# Altium schematic sheet main.SchDoc
size A4
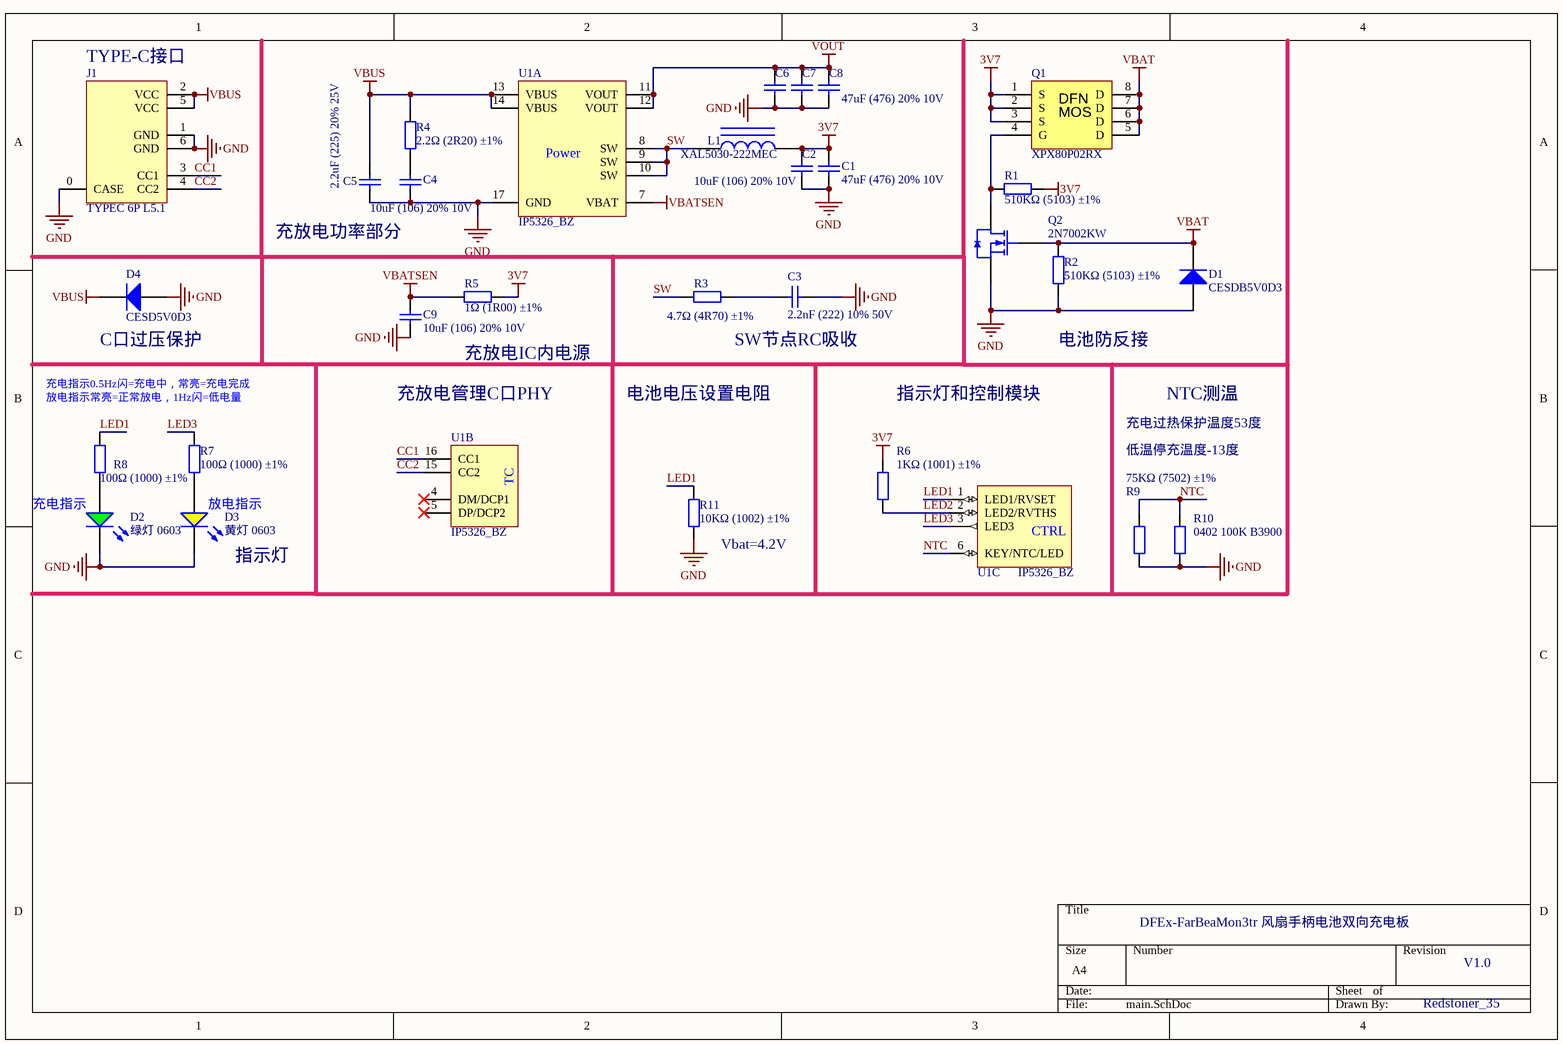
[diagram p0: main.SchDoc]

## Parts
C1  47uF (476) 20% 10V  [0805_C]
C2  10uF (106) 20% 10V  [0402_C]
C3  2.2nF (222) 10% 50V  [0402_C]
C4  10uF (106) 20% 10V  [0402_C]
C5  2.2uF (225) 20% 25V  [0402_C]
C6  47uF (476) 20% 10V  [0805_C]  (value not drawn)
C7  47uF (476) 20% 10V  [0805_C]  (value not drawn)
C8  47uF (476) 20% 10V  [0805_C]
C9  10uF (106) 20% 10V  [0402_C]
D1  CESDB5V0D3  [SOD-323]
D2  绿灯 0603  [0603_LED_S1]
D3  黄灯 0603  [0603_LED_S1]
D4  CESD5V0D3  [SOD-323]
J1  TYPEC 6P L5.1  [TYPEC 6P两脚插板SMT L5.1]
L1  XAL5030-222MEC  [FEXL0520A-***M]
Q1  XPX80P02RX  [DFN-8_L3.0-W3.0-P0.65-BL]
Q2  2N7002KW  [SC70-3]
R1  510KΩ (5103) ±1%  [0402_R]
R2  510KΩ (5103) ±1%  [0402_R]
R3  4.7Ω (4R70) ±1%  [0402_R]
R4  2.2Ω (2R20) ±1%  [0402_R]
R5  1Ω (1R00) ±1%  [0805_R]
R6  1KΩ (1001) ±1%  [0402_R]
R7  100Ω (1000) ±1%  [0402_R]
R8  100Ω (1000) ±1%  [0402_R]
R9  75KΩ (7502) ±1%  [0402_R]
R10  0402 100K B3900  [0402_R]
R11  10KΩ (1002) ±1%  [0402_R]
U1  IP5326_BZ  [QFN33-16L-IP5326]  (parts A,B,C of 3)

## Nets
3V7: C1.2 C2.2 L1.2 Q1.1(S) Q1.2(S) Q1.3(S) R1.1 R5.2 R6.1
GND: C1.1 C2.1 C3.1 C4.1 C5.1 C6.1 C7.1 C8.1 C9.1 D1.1(A) D2.K D3.K D4.1(A) J1.0(CASE) J1.1(GND) J1.6(GND) Q2.2(S) R2.1 R9.1 R10.1 R11.1 U1.17(GND)
VBAT: D1.2(K) Q1.5(D) Q1.6(D) Q1.7(D) Q1.8(D) Q2.1(G) R2.2
VBATSEN: C9.2 R5.1 U1.7(VBAT)
VBUS: C5.2 D4.2(K) J1.2(VCC) J1.5(VCC) R4.2 U1.13(VBUS) U1.14(VBUS)
VOUT: C6.2 C7.2 C8.2 U1.11(VOUT) U1.12(VOUT)
CC1: J1.3(CC1) U1.16(CC1)
CC2: J1.4(CC2) U1.15(CC2)
LED1: R8.2 R11.2 U1.1(LED1/RVSET)
LED2: R6.2 U1.2(LED2/RVTHS)
LED3: R7.2 U1.3(LED3)
NTC: R9.2 R10.2 U1.6(KEY/NTC/LED)
SW: L1.1 R3.2 U1.8(SW) U1.9(SW) U1.10(SW)
NetC3_2: C3.2 R3.1
NetC4_2: C4.2 R4.1
NetD2_A: D2.A R8.1
NetD3_A: D3.A R7.1
NetQ1_4: Q1.4(G) Q2.3(D) R1.2

Not connected (* = marked no-connect by the designer): U1 4(DM/DCP1)* 5(DP/DCP2)*

## Notes on the sheet
- (near J1) TYPE-C接口
- (near C5) 充放电功率部分
- 充电指示0.5Hz闪=充电中，常亮=充电完成
- (near D4) C口过压保护
- 充放电IC内电源
- SW节点RC吸收
- (near R2) 电池防反接
- 放电指示常亮=正常放电，1Hz闪=低电量
- 充放电管理C口PHY
- 电池电压设置电阻
- 指示灯和控制模块
- 充电过热保护温度53度
- 低温停充温度-13度
- NTC测温
- 充电指示
- (near D3) 放电指示
- (near D3) 指示灯
- (near R11) Vbat=4.2V
- DFEx-FarBeaMon3tr 风扇手柄电池双向充电板
- V1.0
- Redstoner_35
- (in symbol IP5326_BZ, part A) Power
- (in symbol IP5326_BZ, part B) TC
- (in symbol IP5326_BZ, part C) CTRL
- (in symbol SON/DFN5x6 MOS) DFN; MOS

## Library data of the parts
C1 C6-C8 = 0805 22uF (226) 20% 25V: 贴片电容; ComponentLink1Description: 供应商链接; ComponentLink1URL: http://www.szlcsc.com/product/details_46786.html; Package: 0805; Supplier: LC; SuppliersPartNumber: C45783
C2 C4 C9 = 0402 10uF (106) 20% 6.3V: 贴片电容; ComponentLink1Description: 供应商链接; ComponentLink1URL: http://www.szlcsc.com/product/details_16204.html; Package: 0402; Supplier: LC; SuppliersPartNumber: C15525
C3 = 0402 2.2nF (222) 10% 50V: 贴片电容; ComponentLink1Description: 供应商链接; ComponentLink1URL: http://www.szlcsc.com/product/details_1883.html; Package: 0402; Supplier: LC; SuppliersPartNumber: C1531
C5 = 0402 1.0uF (105) 10% 25V: 贴片电容; ComponentLink1Description: 供应商链接; ComponentLink1URL: http://www.szlcsc.com/product/details_53938.html; Package: 0402; Supplier: LC; SuppliersPartNumber: C52923
D1 D4 = SOD-323 1N4148WS T4: 5V额定工作电压，6.2V击穿电压双向TVS管，SOD-323; ComponentLink1Description: 供应商链接; ComponentLink1URL: http://www.szlcsc.com/product/details_2485.html; Package: SOD-323; Supplier: LC; SuppliersPartNumber: C2128
D2 = 0603 绿灯: 发光二极管; ComponentLink1Description: 供应商链接; ComponentLink1URL: http://www.szlcsc.com/product/details_73152.html; Package: 0603; Supplier: LC; SuppliersPartNumber: C72043
D3 = 0603 黄灯: 发光二极管; ComponentLink1Description: 供应商链接; ComponentLink1URL: http://www.szlcsc.com/product/details_73147.html; Package: 0603; Supplier: LC; SuppliersPartNumber: C72038
J1 = TYPEC 6P: TYPEC连接器 6P 2脚插板SMT 5.1长度
L1 = Inductor Iron: 线艺XAL5030 2.2uH一体成型T-Core电感; Value: 2.2uH; Published: 24-Mar-1999; LatestRevisionDate: 17-Jul-2002; LatestRevisionNote: Re-released for DXP Platform.; PackageReference: AXIAL-0.9; Publisher: Altium Limited; PackageDescription: Axial Device, Thru-Hole; 2 Leads; 0.9 in Pin Spacing
Q1 = SON/DFN5x6 MOS: PDFN3x3 20V 80A 4..0mΩ [P-Ch MOSFET
Q2 = 2N7002 7002: 单N沟道MOSFET(场效应管); ComponentLink1Description: 供应商链接; ComponentLink1URL: http://www.szlcsc.com/product/details_9040.html; Package: SOT-323; Supplier: LC; SuppliersPartNumber: C???????
R1 R2 = 0402 510KΩ (5103) 1%: 贴片电阻; ComponentLink1Description: 供应商链接; ComponentLink1URL: http://www.szlcsc.com/product/details_12170.html; Package: 0402; Supplier: LC; SuppliersPartNumber: C11616
R3 R4 = 0402 4.7KΩ (4701) 1%: 贴片电阻; ComponentLink1Description: 供应商链接; ComponentLink1URL: http://www.szlcsc.com/product/details_26643.html; Package: 0402; Supplier: LC; SuppliersPartNumber: C25900
R5 = 0805 1Ω (1R00) 1%: 贴片电阻; ComponentLink1Description: 供应商链接; ComponentLink1URL: http://www.szlcsc.com/product/details_26014.html; Package: 0805; Supplier: LC; SuppliersPartNumber: C25271
R6 = 0402 1KΩ (1001) 1%: 贴片电阻; ComponentLink1Description: 供应商链接; ComponentLink1URL: http://www.szlcsc.com/product/details_12256.html; Package: 0402; Supplier: LC; SuppliersPartNumber: C11702
R7 R8 = 0402 100Ω (1000) 1%: 贴片电阻; ComponentLink1Description: 供应商链接; ComponentLink1URL: http://www.szlcsc.com/product/details_25819.html; Package: 0402; Supplier: LC; SuppliersPartNumber: C25076
R9 = 0402 150KΩ (1503) 1%: 贴片电阻; ComponentLink1Description: 供应商链接; ComponentLink1URL: http://www.szlcsc.com/product/details_26498.html; Package: 0402; Supplier: LC; SuppliersPartNumber: C25755
R10 = 0402 100KΩ (1003) 1%: 0402贴片NTC热敏电阻 B4150 100K 1%; ComponentLink1Description: 供应商链接; ComponentLink1URL: http://www.szlcsc.com/product/details_26484.html; Package: 0402; Supplier: LC; SuppliersPartNumber: C25741
R11 = 0402 10KΩ (1002) 1%: 贴片电阻; ComponentLink1Description: 供应商链接; ComponentLink1URL: http://www.szlcsc.com/product/details_26487.html; Package: 0402; Supplier: LC; SuppliersPartNumber: C25744
U1 = IP5326_BZ: 集成TYPC-C协议的2.4A 5V充放电移动电源SoC QFN3*3封装